# Altium schematic sheet Power.SchDoc
size A4; SheetNumber: 2; SheetTotal: 8
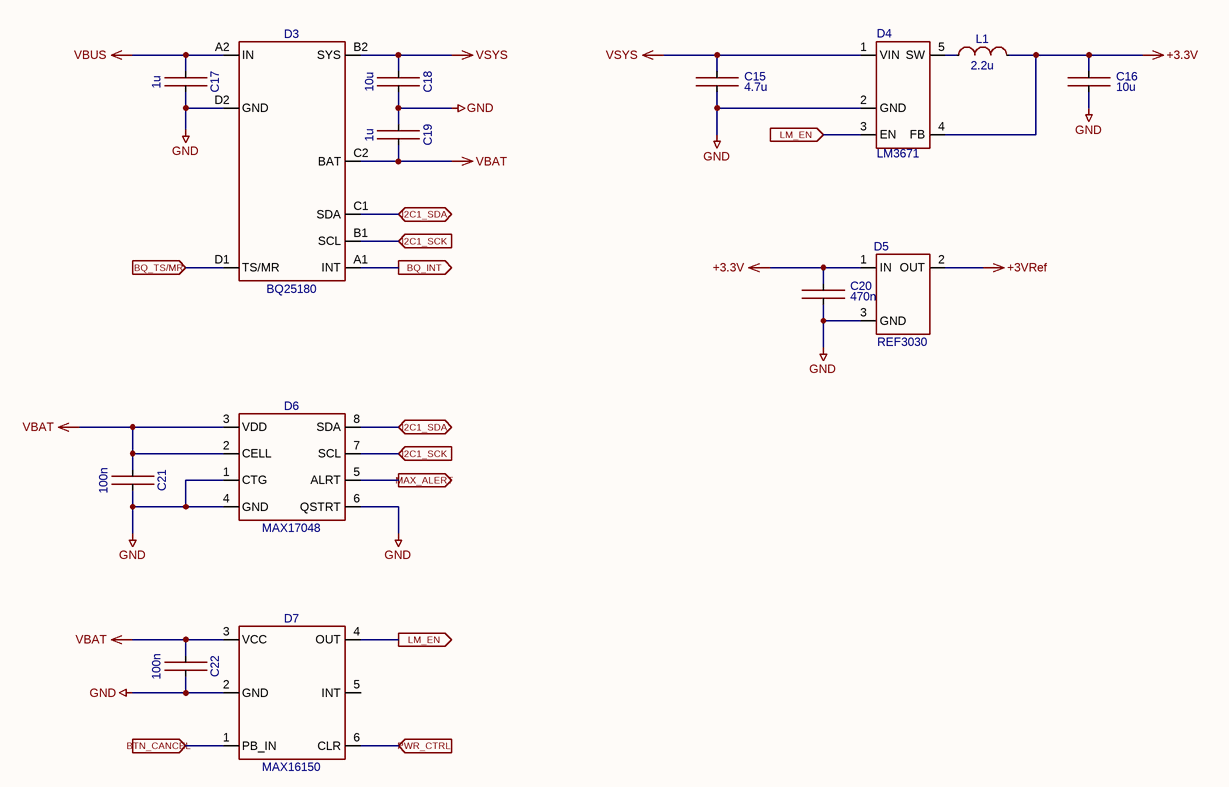
[diagram p0: Power.SchDoc]

## Parts
C15  4.7u  [CAPC1608X09N]
C16  10u  [CAPC1608X09N]
C17  1u  [CAPC1608X09N]
C18  10u  [CAPC1608X09N]
C19  1u  [CAPC1608X09N]
C20  470n  [CAPC1608X09N]
C21  100n  [CAPC1608X09N]
C22  100n  [CAPC1608X09N]
D3  BQ25180  [TI DSBGA (YBG0008)]
D4  LM3671  [TI DBV (R-PDSO-G5)]
D5  REF3030  [TI DBZ (R-PDSO-G3)]
D6  MAX17048  [MAXIM 8 TDFN-EP (T822-3)]
D7  MAX16150  [MAXIM WLP6 (21-0058)]
L1  2.2u  [Murata LQH43CN]

## Ports
BQ_INT (out), BQ_TS/MR (in), BTN_CANCEL (in), I2C1_SCK (in), I2C1_SDA (bidir), LM_EN (in), LM_EN (out), MAX_ALERT (out), PWR_CTRL (in)

## Nets
+3.3V: C16.2 C20.2 D4.4(FB) D5.1(IN) L1.2
+3VRef: D5.2(OUT)
GND: C15.1 C16.1 C17.2 C18.2 C19.1 C20.1 C21.2 C22.2 D3.D2(GND) D4.2(GND) D5.3(GND) D6.1(CTG) D6.4(GND) D6.6(QSTRT) D7.2(GND)
VBAT: C19.2 C21.1 C22.1 D3.C2(BAT) D6.2(CELL) D6.3(VDD) D7.3(VCC)
VBUS: C17.1 D3.A2(IN)
VSYS: C15.2 C18.1 D3.B2(SYS) D4.1(VIN)
BQ_INT: D3.A1(INT) ; port BQ_INT
BQ_TS/MR: D3.D1(TS/MR) ; port BQ_TS/MR
BTN_CANCEL: D7.1(PB_IN) ; port BTN_CANCEL
I2C1_SCK: D3.B1(SCL) D6.7(SCL) ; port I2C1_SCK
I2C1_SDA: D3.C1(SDA) D6.8(SDA) ; port I2C1_SDA
LM_EN: D4.3(EN) D7.4(OUT) ; port LM_EN
MAX_ALERT: D6.5(ALRT) ; port MAX_ALERT
PWR_CTRL: D7.6(CLR) ; port PWR_CTRL
NetD4_5: D4.5(SW) L1.1

Not connected (* = marked no-connect by the designer): D7 5(INT)

## Library data of the parts
C15 = C0603-4.7u-10V-X5R-10%: GRM188R61A475K
C16 C18 = C0603-10u-6.3V-X5R-20%: GRM188R60J106ME47D
C17 C19 = C0603-1u-25V-X7R-10%: GRM188R71E105KA12D
C20 = C0603-470n-16V-X7R-10%: GRM188R71C474KA88D
C21 C22 = C0603-100n-25V-X7R-10%: GRM188R71E104KA01D
D3 = BQ25180YBGR: 1-A Li-ion I²C programmable charger with regulated power path in WCSP package
D4 = LM3671MF-3.3/NOPB
D5 = REF3030AIDBZT
D6 = MAX17048G
D7 = MAX16150A
L1 = L1812-2.2u-0.9A-20%: LQH43CN2R2M03L